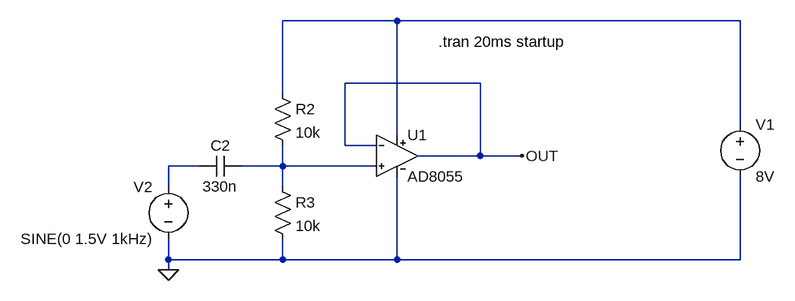
[diagram p0: schematic AD8055-jig.asc]
AD8055-jig.asc, the LTspice schematic file:
Version 4
SHEET 1 904 680
WIRE 112 -80 -64 -80
WIRE 640 -80 112 -80
WIRE 240 16 32 16
WIRE -64 32 -64 -80
WIRE 640 80 640 -80
WIRE 112 96 112 -80
WIRE 32 112 32 16
WIRE 80 112 32 112
WIRE 240 128 240 16
WIRE 240 128 144 128
WIRE 304 128 240 128
WIRE -192 144 -240 144
WIRE -64 144 -64 112
WIRE -64 144 -128 144
WIRE 80 144 -64 144
WIRE -240 176 -240 144
WIRE -64 176 -64 144
WIRE -240 288 -240 256
WIRE -64 288 -64 256
WIRE -64 288 -240 288
WIRE 112 288 112 160
WIRE 112 288 -64 288
WIRE 640 288 640 160
WIRE 640 288 112 288
WIRE -240 304 -240 288
FLAG -240 304 0
FLAG 304 128 OUT
SYMBOL voltage 640 64 R0
WINDOW 123 0 0 Left 0
WINDOW 39 0 0 Left 0
SYMATTR InstName V1
SYMATTR Value 8V
SYMBOL voltage -240 160 M0
WINDOW 123 0 0 Left 0
WINDOW 39 0 0 Left 0
SYMATTR InstName V2
SYMATTR Value SINE(0 1.5V 1kHz)
SYMBOL res -80 16 R0
SYMATTR InstName R2
SYMATTR Value 10k
SYMBOL res -80 160 R0
SYMATTR InstName R3
SYMATTR Value 10k
SYMBOL cap -192 128 M90
WINDOW 0 0 32 VBottom 2
WINDOW 3 32 32 VTop 2
SYMATTR InstName C2
SYMATTR Value 330n
SYMBOL _PERSONAL\\opamps\\AD8055 112 128 R0
SYMATTR InstName U1
TEXT 176 -48 Left 2 !.tran 20ms startup

The netlist it stands for:
* AD8055-jig.asc
V1 N001 0 8V
V2 N002 0 SINE(0 1.5V 1kHz)
R2 N001 N003 10k
R3 N003 0 10k
C2 N002 N003 330n
XU1 N003 OUT N001 0 OUT AD8055  ; pins 1 2 3 4 5
.tran 20ms startup
.lib C:\users\hennep\My Documents\LTspiceXVII\lib\sym\_PERSONAL\opamps\AD8055.sub
.backanno
.end